# EAGLE design matchbox_dpy_sm_v10 (EAGLE 7.4.0)
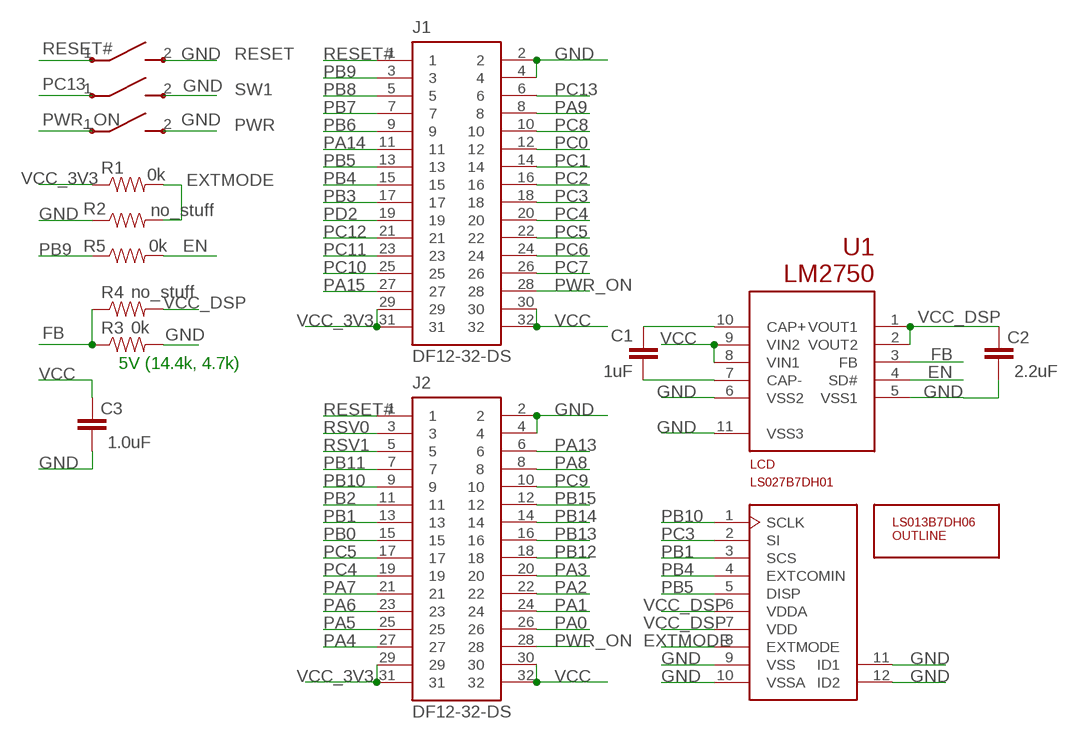
[diagram p0: schematic, sheet 1]

## Parts
C1  1uF  CAP0805  [0805]
C2  2.2uF  CAP0805  [0805]
C3  1.0uF  CAP0805  [0805]
J1  DF12-32-DS  AS-ITM-00012  [DF12-32-DS]
J2  DF12-32-DS  AS-ITM-00012  [DF12-32-DS]
LCD  LS027B7DH01  [MOLEX-51441-1093]
PWR  B3U-3100PM-B  [B3U-3100PM-B]
R1  0k  RESISTOR0805-RES  [0805]
R2  no_stuff  RESISTOR0805-RES  [0805]
R3  0k  RESISTOR0805-RES  [0805]
R4  no_stuff  RESISTOR0805-RES  [0805]
R5  0k  RESISTOR0805-RES  [0805]
RESET  B3U-3100PM-B  [B3U-3100PM-B]
SW1  B3U-3100PM-B  [B3U-3100PM-B]
U1  LM2750  [LM2750]
U$1  LS013B7DH06-OUTLINE  [LS013B7DH06]

## Nets
EN: R5.2 U1.4(SD#)
EXTMODE: LCD.8(EXTMODE) R1.2 R2.2
FB: R3.1 R4.1 U1.3(FB)
GND: C2.2 C3.2 J1.2 J1.4 J2.2 J2.4 LCD.9(VSS) LCD.10(VSSA) LCD.11(ID1) LCD.12(ID2) PWR.2 R2.1 R3.2 RESET.2 SW1.2 U1.5(VSS1) U1.6(VSS2) U1.11(VSS3)
N$1: C1.1 U1.10(CAP+)
N$2: C1.2 U1.7(CAP-)
PA0: J2.26
PA1: J2.24
PA2: J2.22
PA3: J2.20
PA4: J2.27
PA5: J2.25
PA6: J2.23
PA7: J2.21
PA8: J2.8
PA9: J1.8
PA13: J2.6
PA14: J1.11
PA15: J1.27
PB0: J2.15
PB1: J2.13 LCD.3(SCS)
PB2: J2.11
PB3: J1.17
PB4: J1.15 LCD.4(EXTCOMIN)
PB5: J1.13 LCD.5(DISP)
PB6: J1.9
PB7: J1.7
PB8: J1.5
PB9: J1.3 R5.1
PB10: J2.9 LCD.1(SCLK)
PB11: J2.7
PB12: J2.18
PB13: J2.16
PB14: J2.14
PB15: J2.12
PC0: J1.12
PC1: J1.14
PC2: J1.16
PC3: J1.18 LCD.2(SI)
PC4: J1.20 J2.19
PC5: J1.22 J2.17
PC6: J1.24
PC7: J1.26
PC8: J1.10
PC9: J2.10
PC10: J1.25
PC11: J1.23
PC12: J1.21
PC13: J1.6 SW1.1
PD2: J1.19
PWR_ON: J1.28 J2.28 PWR.1
RESET#: J1.1 J2.1 RESET.1
RSV0: J2.3
RSV1: J2.5
VCC: C3.1 J1.30 J1.32 J2.30 J2.32 U1.8(VIN1) U1.9(VIN2)
VCC_3V3: J1.29 J1.31 J2.29 J2.31 R1.1
VCC_DSP: C2.1 LCD.6(VDDA) LCD.7(VDD) R4.2 U1.1(VOUT1) U1.2(VOUT2)

## Notes on the sheet
- 5V (14.4k, 4.7k)

## Power pins joined to a net without a drawn wire
GND: PWR.GND RESET.GND SW1.GND

## Library data of the parts
C1-C3 = SparkFun-Passives:CAP: Capacitor Standard 0603 ceramic capacitor, and 0.1" leaded capacitor.; MF: CORNELL DUBILIER; MPN: 106K050CS4; OC_NEWARK: 01F367
J1 J2 = micro1292:AS-ITM-00012: CONN RECEPT 32POS 3MM SMD 0.5MM; PARTNO: AS-ITM-00012
LCD = sharp_display:LS027B7DH01
PWR RESET SW1 = sharp_display:B3U-3100PM-B
R1-R5 = SparkFun-Passives:RESISTOR: Resistor Basic schematic elements and footprints for 0603, 1206, and PTH resistors.
U1 = sharp_display:LM2750
U$1 = sharp_display:LS013B7DH06-OUTLINE

## Board
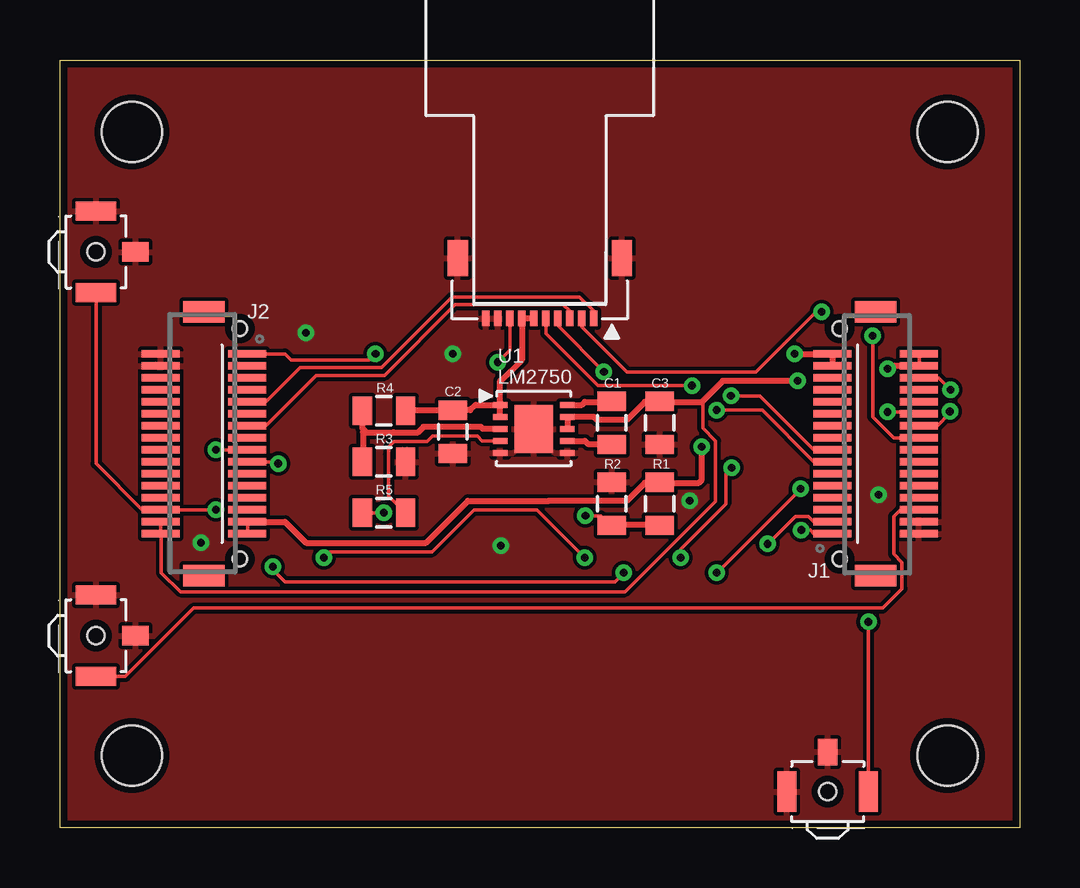
[diagram p1: board, top side]
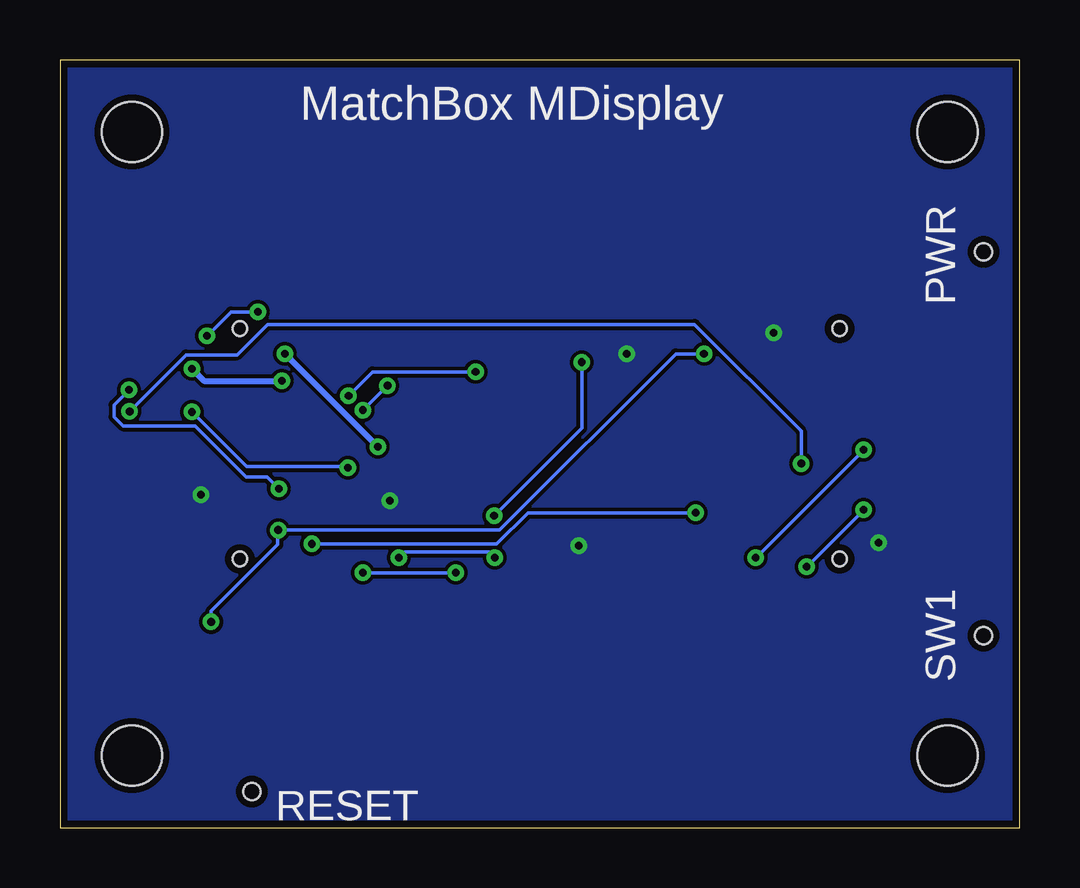
[diagram p2: board, bottom side, seen from below]

Size 40 x 32 mm. Coordinates in mm from the lower left corner, seen from the top.
Outline: 40,0 0,0 0,32 40,32 40,0
Copper layers (1*16): Top 0.0356mm / dielectric 1.5011mm / Bottom 0.0356mm
Design rules "LaenPCBOrder (2) *": minimum track width 6mil, minimum drill 13mil, track to track 6mil, track to pad 6mil, pad to pad 6mil, via to via 6mil, smd to smd 6mil, copper to edge 12mil, drill to drill 6mil, minimum pad ring 7mil, minimum via ring 7mil, stop-mask expansion 14mil, vias tented up to drill 14mil, thermal gap 6mil
Holes 2.5 mm at 3,29 37,29 37,3 3,3

### Footprints (pad centres in the part's own frame; a part is rotated, then mirrored left to right if it is on the bottom)
0805 = smd 0.8 x 1.2: 1 -0.9,0; 2 0.9,0
DF12-32-DS = smd 0.3 x 1.6: 1 -3.75,1.8; 2 -3.75,-1.8; 3 -3.25,1.8; 4 -3.25,-1.8; 5 -2.75,1.8; 6 -2.75,-1.8; 7 -2.25,1.8; 8 -2.25,-1.8; 9 -1.75,1.8; 10 -1.75,-1.8; 11 -1.25,1.8; 12 -1.25,-1.8; 13 -0.75,1.8; 14 -0.75,-1.8; 15 -0.25,1.8; 16 -0.25,-1.8; 17 0.25,1.8; 18 0.25,-1.8; 19 0.75,1.8; 20 0.75,-1.8; 21 1.25,1.8; 22 1.25,-1.8; 23 1.75,1.8; 24 1.75,-1.8; 25 2.25,1.8; 26 2.25,-1.8; 27 2.75,1.8; 28 2.75,-1.8; 29 3.25,1.8; 30 3.25,-1.8; 31 3.75,1.8; 32 3.75,-1.8 | smd 0.889 x 1.727: F1 -5.5,0; F2 5.5,0 | hole 0.6: -4.8,1.5; 4.8,1.5
MOLEX-51441-1093 = smd 0.3 x 0.65: 1 -2.25,3.275; 2 -1.75,3.275; 3 -1.25,3.275; 4 -0.75,3.275; 5 -0.25,3.275; 6 0.25,3.275; 7 0.75,3.275; 8 1.25,3.275; 9 1.75,3.275; 10 2.25,3.275 | smd 0.85 x 1.5: 11 -3.425,0.75; 12 3.425,0.75
B3U-3100PM-B = smd 0.8 x 1.7: 1 -1.7,0; 2 1.7,0 | smd 0.8 x 1.1: GND 0,-1.65 | hole 0.7: 0,0
LM2750 = smd 0.25 x 0.6: 1 -1,-1.4; 2 -0.5,-1.4; 3 0,-1.4; 4 0.5,-1.4; 5 1,-1.4; 6 1,1.4; 7 0.5,1.4; 8 0,1.4; 9 -0.5,1.4; 10 -1,1.4 | smd 2 x 1.6: 11 0,0

### Placement (x,y rotation side)
C1  23,16.88 270 top
C2  16.38,16.5 270 top
C3  25,16.88 270 top
J1  34,16 90 top
J2  6,16 270 top
LCD  20,24.5 180 top
PWR  1.5,24 90 top
R1  25,13.5 270 top
R2  23,13.5 270 top
R3  13.5,15.25 0 top
R4  13.5,17.38 0 top
R5  13.5,13.12 0 top
RESET  32,1.5 180 top
SW1  1.5,8 90 top
U1  19.75,16.62 270 top
U$1  20,35.5 0 top  (outside the outline)

### Tracks (layer width: path | path; a pad name or v marks a point on that pad's centre or on a via)
EN
  Top 0.152: U1.4 17.6,16.12 17.4,16.32 15.53,16.32 15.3,16.1 14.93,16.1 14.88,16.1 14.4,16.1 14.32,16.1 13.93,16.1 13.7,15.88 13.7,15.6 13.7,15.53 13.7,14.62 13.7,14.55 13.7,13.82 R5.2
EXTMODE  (via drill 0.33)
  Top 0.152: LCD.8 18.75,19.9 v18.25,19.4 | v21.9,13 22.55,13 22.88,12.68 R2.2
  Top 0.254: R2.2 23,12.62 25,12.62 R1.2
  Bottom 0.152: v18.25,19.4 18.25,16.65 v21.9,13
FB
  Top 0.254: U1.3 17.62,16.62 17.55,16.7 15.15,16.7 14.93,16.48 13.93,16.48 13.9,16.48 12.78,16.48 | 12.78,16.48 12.6,16.65 R4.1 | R3.1 12.62,15.25 12.62,16.48 12.78,16.48
GND  (via drill 0.33)
  other vias: 10.25,20.62 16.38,19.75 18.38,11.75 34.12,13.88 26.25,13.62 5.88,11.88
  pour Bottom: 40,0 0,0 0,32 40,32
  pour Top: 40,0 0,0 0,32 40,32
N$1
  Top 0.254: C1.1 23,17.75 21.88,17.75 21.75,17.62 21.25,17.62 U1.10
N$2
  Top 0.254: C1.2 23,16 22,16 21.88,16.12 21.25,16.12 U1.7
PB1
  Top 0.152: LCD.3 21.25,21.52 20.98,21.8 16.48,21.8 13.53,18.85 10.68,18.85 8.57,16.75 7.83,16.75 J2.13
PB4  (via drill 0.33)
  Top 0.152: LCD.4 20.75,20.93 v22.68,19 | v27.98,18 29.18,18 31.43,15.75 32.17,15.75 J1.15
  Bottom 0.152: v22.68,19 26.98,19 v27.98,18
PB5  (via drill 0.33)
  Top 0.152: LCD.5 20.25,20.6 22.43,18.43 v26.35,18.43 | v27.38,17.4 29.27,17.4 31.43,15.25 32.17,15.25 J1.13
  Bottom 0.152: v27.38,17.4 v26.35,18.43
PB9  (via drill 0.33)
  Top 0.152: v13.5,13.12 R5.1 | v29.5,11.82 30.65,12.97 31.2,12.97 31.43,12.75 32.17,12.75 J1.3
  Bottom 0.152: v13.5,13.12 20.5,13.12 21.8,11.82 v29.5,11.82
PB10
  Top 0.152: LCD.1 22.25,21.52 21.65,22.12 16.35,22.12 13.4,19.18 10,19.18 8.57,17.75 7.83,17.75 J2.9
PC3  (via drill 0.33)
  Top 0.152: LCD.2 21.75,21.12 21.75,20.88 23.62,19 28.88,19 29,19 31.5,21.5 v31.75,21.5 | v33.88,20.5 33.88,17.12 34.75,16.25 35.75,16.25 J1.18
  Bottom 0.152: v31.75,21.5 32.88,21.5 v33.88,20.5
PC4  (via drill 0.33)
  Top 0.152: v9.1,15.18 9.03,15.25 7.83,15.25 J2.19 | v37.1,17.35 37.1,17.27 36.58,16.75 35.83,16.75 J1.20
  Bottom 0.152: v9.1,15.18 9.1,16.52 13.55,20.98 31.35,20.98 32.62,19.7 34.75,19.7 v37.1,17.35
PC5  (via drill 0.33)
  Top 0.152: v34.5,17.32 35.73,17.32 J1.22 | J1.22 | v11,11.25 11.25,11.5 15.5,11.5 17.25,13.25 19.88,13.25 20.12,13 v21.88,11.25 | v6.5,15.75 7.75,15.75 J2.17 | v25.88,11.25 25.88,11.62 27.75,13.5 27.75,14.75 v28,15
  Bottom 0.152: v34.5,17.32 32.23,15.05 28,15.05 v28,15 | v6.5,15.75 v11,11.25 | v21.88,11.25 22.12,11.5 25.62,11.5 v25.88,11.25
PC13
  Top 0.152: J1.6 35.02,13.25 34.75,12.97 34.75,11.4 35.1,11.05 35.1,9.95 34.3,9.15 5.58,9.15 2.73,6.3 SW1.1 | J1.6
PWR_ON  (via drill 0.33)
  Top 0.152: PWR.1 1.5,15.18 3.42,13.25 4.17,13.25 J2.28 4.25,13.25 v6.5,13.25 | v8.88,10.88 8.88,10.75 9.38,10.25 23.12,10.25 v23.5,10.62 | v30.88,14.12 v27.38,10.62 | v37.12,18.25 36.62,18.75 35.88,18.75 J1.28
  Bottom 0.152: v6.5,13.25 v8.88,10.88 | v27.38,10.62 v23.5,10.62 | v30.88,14.12 31.38,14.62 32.25,14.62 34.38,16.75 37.38,16.75 37.75,17.12 37.75,17.62 v37.12,18.25
RESET#  (via drill 0.33)
  Top 0.152: v30.9,12.4 31.27,12.4 31.43,12.25 32.17,12.25 J1.1 | 7.83,19.75 J2.1 | v33.7,8.57 RESET.1 | 13.12,19.75 v13.15,19.75 13.12,19.75 | 7.88,19.75 J2.1 | 13.12,19.75 12.88,19.5 9.88,19.5 9.62,19.5 9.38,19.75 7.88,19.75 | 7.88,19.75 J2.1
  Bottom 0.152: v13.15,19.75 14.32,19.75 21.68,12.4 v30.9,12.4 30.93,12.32 30.93,11.8 33.7,9.03 v33.7,8.57
VCC  (via drill 0.33)
  Top 0.152: J1.32 35.83,19.75 35.83,19.38 J1.30 | J2.30 J2.32 | J2.32 | J2.30 | 26.75,17.75 26.8,17.7 26.8,16.65 27.32,16.12 27.32,13.6 23.55,9.82 5.03,9.82 4.22,10.62 4.22,12.18 J2.32
  Top 0.254: U1.8 U1.9 21.25,17.12 22.25,17.12 22.38,17 23.62,17 24.38,17.75 25,17.75 C3.1 25.12,17.75 26.75,17.75 27.62,18.62 v30.75,18.62 | v34.5,19.12 34.62,19.25 35.75,19.25 J1.30
  Bottom 0.254: v30.75,18.62 34,18.62 v34.5,19.12
VCC_3V3  (via drill 0.33)
  Top 0.152: J2.31 7.83,12.25 7.83,12.62 J2.29
  Top 0.254: J1.29 J1.31 32.12,19.75 v30.62,19.75 | J2.29 7.88,12.75 9.38,12.75 10.25,11.88 15.25,11.88 17,13.62 20.38,13.62 23.62,13.62 24.38,14.38 25,14.38 R1.1 25.12,14.38 26.62,14.38 26.75,14.5 v26.75,15.88
  Bottom 0.254: v26.75,15.88 v30.62,19.75
VCC_DSP
  Top 0.254: U1.2 U1.1 | U1.1 18.23,17.62 17.32,17.62 17.1,17.4 C2.1 14.43,17.4 R4.2 | 18.35,18.6 18.35,18.62 18.35,18.6 | 18.35,18.6 19.25,19.5 LCD.7 LCD.6 | 18.35,18.6 18.35,17.75 U1.1

### Text on the board
bNames: MatchBox MDisplay